# Altium schematic sheet CATS-FAT-Accel.SchDoc: CATS Pro
size A4; Author: Luca Jost; Revision: 1.0; SheetNumber: 12; SheetTotal: 13; Subtitle: Accelerometer
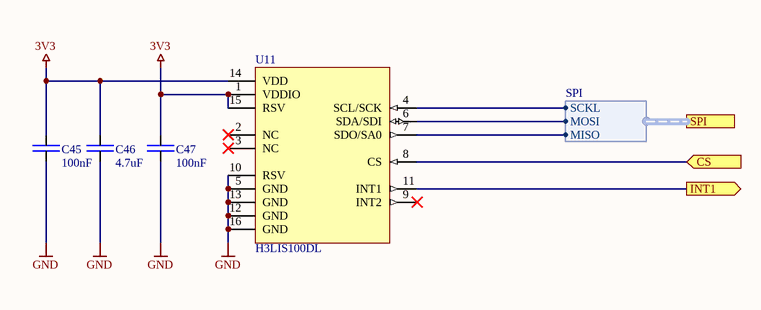
[diagram p0: CATS-FAT-Accel.SchDoc]

## Parts
C45  100nF  [SMD Keramikkondensator 0603]
C46  4.7uF  [SMD Keramikkondensator 0603]
C47  100nF  [SMD Keramikkondensator 0603]
U11  H3LIS100DL  [SMD IC LGA-16 5/3]

## Ports
CS (in), INT1 (out), SPI (harness SPI)

## Harnesses
SPI: SCKL, MOSI, MISO

## Nets
3V3: C45.2 C46.2 C47.2 U11.1(VDDIO) U11.14(VDD) U11.15(RSV)
GND: C45.1 C46.1 C47.1 U11.5(GND) U11.10(RSV) U11.12(GND) U11.13(GND) U11.16(GND)
CS: U11.8(CS) ; port CS
INT1: U11.11(INT1) ; port INT1
NetU11_4: U11.4(SCL/SCK) ; port SPI.SCKL
NetU11_6: U11.6(SDA/SDI) ; port SPI.MOSI
NetU11_7: U11.7(SDO/SA0) ; port SPI.MISO

Not connected (* = marked no-connect by the designer): U11 2(NC)* 3(NC)* 9(INT2)*

## Notes on the sheet
- Title
- Author:
- Subtitle
- Date:
- Rev:
- CATS
- Sheet
- of
- File:

## Library data of the parts
C45 C47 = E6 - 100nF: SMD Ceramic Capacitor E6; Unit Price: 0.01; Number: -; Supplier: -
C46 = E6 - 4.7uF: SMD Ceramic Capacitor E6; Unit Price: 0.01; Number: -; Supplier: -
U11 = H3LIS100DL: Low-Power 100-g 3-Axis Digital Accelerometer; ComponentLink1Description: Datasheet; ComponentLink1URL: https://www.st.com/content/ccc/resource/technical/document/datasheet/6e/c2/95/d9/3a/3f/4f/cb/DM00162193.pdf/files/DM00162193.pdf/jcr:content/translations/en.DM00162193.pdf; Digikey: 497-15697-1-ND